# Altium schematic sheet SD_Card.SchDoc
size A4
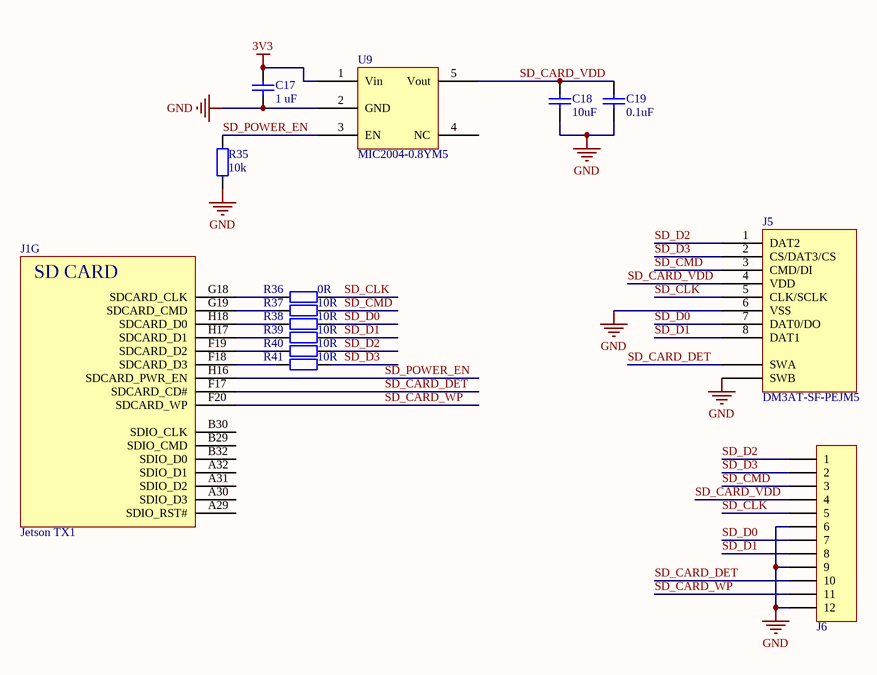
[diagram p0: SD_Card.SchDoc]

## Parts
C17  Capacitance: 1 uF  [0603C_M]  (hidden comment: GRM188R61A105KA61D)
C18  value 10uF  [0603C_M]  (hidden comment: GRM188R60J106ME47D)
C19  Capacitance: 0.1uF  [0402C_M]  (hidden comment: GRM155R71C104KA88D)
J1  Jetson TX1  [Nvidia Jetson TX1]  (part G of 14)
J5  DM3AT-SF-PEJM5  [DM3AT-SF-PEJM5]
J6  0527451297  [52745-1297]  (value not drawn)
R35  value 10k  [0402R_M]  (hidden comment: CRCW040210K0FKED)
R36  value 0R  [0402R_M]  (hidden comment: Generic resitor)
R37  value 10R  [0402R_M]  (hidden comment: CRCW040210R0FKED)
R38  value 10R  [0402R_M]  (hidden comment: CRCW040210R0FKED)
R39  value 10R  [0402R_M]  (hidden comment: CRCW040210R0FKED)
R40  value 10R  [0402R_M]  (hidden comment: CRCW040210R0FKED)
R41  value 10R  [0402R_M]  (hidden comment: CRCW040210R0FKED)
U9  MIC2004-0.8YM5  [SOT23_M5_M]

## Nets
3V3: C17.2 U9.1(Vin)
GND: C17.1 C18.1 C19.1 J5.6(VSS) J5.SWB J6.6 J6.9 J6.12 R35.1 U9.2(GND)
SD_CARD_DET: J1.F17(SDCARD_CD#) J5.SWA J6.10
SD_CARD_VDD: C18.2 C19.2 J5.4(VDD) J6.4 U9.5(Vout)
SD_CARD_WP: J1.F20(SDCARD_WP) J6.11
SD_CLK: J5.5(CLK/SCLK) J6.5 R36.2
SD_CMD: J5.3(CMD/DI) J6.3 R37.2
SD_D0: J5.7(DAT0/DO) J6.7 R38.2
SD_D1: J5.8(DAT1) J6.8 R39.2
SD_D2: J5.1(DAT2) J6.1 R40.2
SD_D3: J5.2(CS/DAT3/CS) J6.2 R41.2
SD_POWER_EN: J1.H16(SDCARD_PWR_EN) R35.2 U9.3(EN)
NetJ1_F18: J1.F18(SDCARD_D3) R41.1
NetJ1_F19: J1.F19(SDCARD_D2) R40.1
NetJ1_G18: J1.G18(SDCARD_CLK) R36.1
NetJ1_G19: J1.G19(SDCARD_CMD) R37.1
NetJ1_H17: J1.H17(SDCARD_D1) R39.1
NetJ1_H18: J1.H18(SDCARD_D0) R38.1

Not connected (* = marked no-connect by the designer): J1 A29(SDIO_RST#) A30(SDIO_D3) A31(SDIO_D2) A32(SDIO_D1) B29(SDIO_CMD) B30(SDIO_CLK) B32(SDIO_D0); U9 4(NC)

## Notes on the sheet
- (in symbol NVIDIA_Jetson_TX1, part G) SD CARD

## Library data of the parts
C17 = GRM188R61A105KA61D: CAP CER 1UF 10V X5R 0603; Manufacturer: Murata; Capacitance - nF: 1000 nF; Brand: Murata Electronics; Tolerance: 10 %; Case Height: 0.8 mm; Case Length: 1.6 mm; Temperature Coefficient / Code: +/- 15 %; Type: General Purpose MLCC; Supplier 1: Digi-Key; Manufacturer Part Number: GRM188R61A105KA61D; Stock 1: 2238936; Pricing 1: 1=0.1, 10=0.04, 100=0.0178, 500=0.0127, 1000=0.01 (USD); Dimensions: 0.8 mm W x 1.6 mm L x 0.8 mm H; Product Category: Multilayer Ceramic Capacitors MLCC - SMD/SMT; RoHS: Details; Voltage Rating DC: 10 V; Dielectric: X5R; Case Code - in: 0603; Case Code - mm: 1608; Minimum Operating Temperature: - 55 C; Maximum Operating Temperature: + 85 C; Product: General Type MLCCs; Case Width: 0.8 mm; Operating Temperature Range: - 55 C to + 85 C; Package / Case: 0603 (1608 metric); Packaging: Reel; Series: GRM; Factory Pack Quantity: 4000; Termination Style: SMD/SMT; ComponentLink1URL: https://datasheet.ciiva.com/18102/getdatasheetpartid-85467-18102910.pdf; ComponentLink1Description: https://datasheet.ciiva.com/18102/getdatasheetpartid-85467-18102910.pdf; ComponentLink2URL: https://datasheet.ciiva.com/19476/1857381-19476568.pdf; ComponentLink2Description: https://datasheet.ciiva.com/19476/1857381-19476568.pdf; ComponentLink3URL: https://datasheet.ciiva.com/131/partnumbering-e-01-131743.pdf; ComponentLink3Description: https://datasheet.ciiva.com/131/partnumbering-e-01-131743.pdf; ComponentLink4URL: https://datasheet.ciiva.com/22706/608985-22706782.pdf; ComponentLink4Description: https://datasheet.ciiva.com/22706/608985-22706782.pdf; ComponentLink5URL: https://datasheet.ciiva.com/131/partnumbering-e-01-131742.pdf; ComponentLink5Description: https://datasheet.ciiva.com/131/partnumbering-e-01-131742.pdf; ComponentLink6URL: https://datasheet.ciiva.com/7719/608985-7719036.pdf; ComponentLink6Description: https://datasheet.ciiva.com/7719/608985-7719036.pdf; ComponentLink7URL: https://datasheet.ciiva.com/16199/product-16199724.pdf; ComponentLink7Description: https://datasheet.ciiva.com/16199/product-16199724.pdf; ComponentLink8URL: https://datasheet.ciiva.com/131/partnumbering-e-01-131741.pdf; ComponentLink8Description: https://datasheet.ciiva.com/131/partnumbering-e-01-131741.pdf; Supplier Part Number 1: 490-1543-1-ND; Voltage Rating: 10 V
C18 = GRM188R60J106ME47D: CAP CER 10UF 6.3V X5R 0603; Manufacturer: Murata Electronics North America; Tolerance: ±20%; Supplier 1: Digi-Key; Manufacturer Part Number: GRM188R60J106ME47D; RoHS: RoHS Compliant; Category: Capacitors; Stock 1: 13697850; Pricing 1: 1=0.17, 10=0.123, 100=0.0578, 500=0.04052, 1000=0.03355 (USD); Packaging: Cut Tape (CT); Part Status: Active; Voltage - Rated: 6.3V; Temperature Coefficient: X5R; Operating Temperature: -55°C ~ 85°C; Features: -; Ratings: -; Applications: General Purpose; Mounting Type: Surface Mount, MLCC; Package / Case: 0603 (1608 Metric); Size / Dimension: 0.063" L x 0.031" W (1.60mm x 0.80mm); Height - Seated (Max): -; Thickness (Max): 0.035" (0.90mm); Lead Spacing: -; Lead Style: -; ComponentLink1URL: http://www.murata.com/~/media/webrenewal/support/library/catalog/products/capacitor/mlcc/c02e.pdf; ComponentLink1Description: http://www.murata.com/~/media/webrenewal/support/library/catalog/products/capacitor/mlcc/c02e.pdf; Supplier Part Number 1: 490-3896-1-ND
C19 = GRM155R71C104KA88D: CAP CER 0.1UF 16V X7R 0402; Manufacturer: Murata Electronics North America; Tolerance: ±10%; Supplier 1: Digi-Key; Manufacturer Part Number: GRM155R71C104KA88D; RoHS: RoHS Compliant; Category: Capacitors; Stock 1: 58190082; Pricing 1: 1=0.1, 10=0.013, 100=0.0059, 500=0.00422, 1000=0.00332, 2500=0.00302, 5000=0.00278 (USD); Packaging: Cut Tape (CT); Part Status: Active; Voltage - Rated: 16V; Temperature Coefficient: X7R; Operating Temperature: -55°C ~ 125°C; Features: -; Ratings: -; Applications: General Purpose; Mounting Type: Surface Mount, MLCC; Package / Case: 0402 (1005 Metric); Size / Dimension: 0.039" L x 0.020" W (1.00mm x 0.50mm); Height - Seated (Max): -; Thickness (Max): 0.022" (0.55mm); Lead Spacing: -; Lead Style: -; ComponentLink1URL: http://www.murata.com/~/media/webrenewal/support/library/catalog/products/capacitor/mlcc/c02e.ashx; ComponentLink1Description: http://www.murata.com/~/media/webrenewal/support/library/catalog/products/capacitor/mlcc/c02e.ashx; Supplier Part Number 1: 490-3261-1-ND
J1 = NVIDIA_Jetson_TX1: Nvidia computing module
J5 = DM3AT-SF-PEJM5: CONN MICRO SD CARD PUSH-PUSH R/A; Manufacturer: Hirose Electric (HRS); Product Training Modules: DM3 Series microSD Card Sockets; Featured Product: DM3AT Series; HTML Datasheet: DM3 Series microSD.html; Card Type: Secure Digital - microSD™; Number of Positions: 10 (8 + 2); Connector Type: Connector and Ejector; Insertion, Removal Method: Push In, Push Out; Online Catalog: DM3 Series; Other Names: HR1964CT; Supplier 1: Digi-Key; Manufacturer Part Number: DM3AT-SF-PEJM5; Stock 1: 32079; Pricing 1: 1=2.88, 10=2.614, 25=2.454, 50=2.3474, 100=2.2407, 250=2.0273, 500=1.8673 (USD); Standard Package: 1; Category: Connectors, Interconnects; Family: Memory Connectors - PC Card Sockets; Series: DM3; Packaging: Cut Tape (CT); Ejector Side: -; Mounting Type: Surface Mount, Right Angle; Features: Switch; Height Above Board: 0.066" (1.68mm); Mounting Feature: Normal, Standard - Top; Contact Finish: Gold; Contact Finish Thickness: -; ComponentLink1URL: https://datasheet.ciiva.com/46418/1697167-46418262.pdf; ComponentLink1Description: https://datasheet.ciiva.com/46418/1697167-46418262.pdf; ComponentLink2URL: https://datasheet.ciiva.com/3122/e60900232-3122534.pdf; ComponentLink2Description: https://datasheet.ciiva.com/3122/e60900232-3122534.pdf; ComponentLink3URL: https://datasheet.ciiva.com/16205/e60900232-16205727.pdf; ComponentLink3Description: https://datasheet.ciiva.com/16205/e60900232-16205727.pdf; ComponentLink4URL: https://datasheet.ciiva.com/16655/e60900232-16655643.pdf; ComponentLink4Description: https://datasheet.ciiva.com/16655/e60900232-16655643.pdf; ComponentLink5URL: https://datasheet.ciiva.com/683/e60900232-683394.pdf; ComponentLink5Description: https://datasheet.ciiva.com/683/e60900232-683394.pdf; ComponentLink6URL: https://datasheet.ciiva.com/683/e60900232-683393.pdf; ComponentLink6Description: https://datasheet.ciiva.com/683/e60900232-683393.pdf; ComponentLink7URL: https://datasheet.ciiva.com/46418/1697167-46418261.pdf; ComponentLink7Description: https://datasheet.ciiva.com/46418/1697167-46418261.pdf; ComponentLink8URL: https://datasheet.ciiva.com/683/e60900232-683395.pdf; ComponentLink8Description: https://datasheet.ciiva.com/683/e60900232-683395.pdf; Supplier Part Number 1: HR1964DKR-ND
J6 = 0527451297: CONN FFC TOP 12POS 0.50MM R/A; Manufacturer: Molex, LLC; Connector/Contact Type: Contacts, Top; Number of Positions: 12; Pitch: 0.020" (0.50mm); FFC, FCB Thickness: 0.30mm; Locking Feature: Slide Lock; Cable End Type: Straight; Voltage Rating: 50V; Current Rating: 0.5A; Mating Cycles: 20; Supplier 1: Digi-Key; Manufacturer Part Number: 0527451297; RoHS: RoHS Compliant; Category: Connectors, Interconnects; Stock 1: 6854; Pricing 1: 1=1.4, 10=1.234, 25=1.1616, 50=1.1132, 100=1.0648, 250=0.968, 500=0.8712 (USD); Packaging: Cut Tape (CT); Part Status: Active; Flat Flex Type: -; Mounting Type: Surface Mount, Right Angle; Termination: Solder; Height Above Board: 0.079" (2.00mm); Contact Material: Phosphor Bronze; Contact Finish: Gold; Housing Material: Polyamide (PA46), Nylon 4/6, Glass Filled; Actuator Material: -; Features: Solder Retention, Zero Insertion Force (ZIF); Operating Temperature: -20°C ~ 85°C; Material Flammability Rating: -; Contact Finish Thickness: -; Housing Color: -; Actuator Color: -; ComponentLink1URL: http://www.molex.com/pdm_docs/sd/527451297_sd.pdf; ComponentLink1Description: http://www.molex.com/pdm_docs/sd/527451297_sd.pdf; Supplier Part Number 1: WM6767CT-ND
R35 = CRCW040210K0FKED: RES SMD 10K OHM 1% 1/16W 0402; Manufacturer: Vishay Dale; Power (Watts): 0.063W, 1/16W; Temperature Coefficient: ±100ppm/°C; Supplier 1: Digi-Key; Manufacturer Part Number: CRCW040210K0FKED; RoHS: RoHS Compliant; Category: Resistors; Stock 1: 0; Pricing 1: 1=0.1, 10=0.037, 100=0.0149, 1000=0.0067, 2500=0.00582, 5000=0.00481 (USD); Packaging: Cut Tape (CT); Part Status: Active; Tolerance: ±1%; Composition: Thick Film; Features: Automotive AEC-Q200; Operating Temperature: -55°C ~ 155°C; Package / Case: 0402 (1005 Metric); Supplier Device Package: 0402; Size / Dimension: 0.039" L x 0.020" W (1.00mm x 0.50mm); Height - Seated (Max): 0.016" (0.40mm); Failure Rate: -; ComponentLink1URL: http://www.vishay.com/docs/20035/dcrcwe3.pdf; ComponentLink1Description: http://www.vishay.com/docs/20035/dcrcwe3.pdf; Supplier Part Number 1: 541-10.0KLCT-ND
R36 = Resistor
R37-R41 = CRCW040210R0FKED: RES SMD 10 OHM 1% 1/16W 0402; Manufacturer: Vishay Dale; Power (Watts): 0.063W, 1/16W; Temperature Coefficient: ±100ppm/°C; Supplier 1: Digi-Key; Manufacturer Part Number: CRCW040210R0FKED; RoHS: RoHS Compliant; Category: Resistors; Stock 1: 0; Pricing 1: 1=0.1, 10=0.037, 100=0.0149, 1000=0.0067, 2500=0.00582, 5000=0.00481 (USD); Packaging: Cut Tape (CT); Part Status: Active; Tolerance: ±1%; Composition: Thick Film; Features: Automotive AEC-Q200; Operating Temperature: -55°C ~ 155°C; Package / Case: 0402 (1005 Metric); Supplier Device Package: 0402; Size / Dimension: 0.039" L x 0.020" W (1.00mm x 0.50mm); Height - Seated (Max): 0.016" (0.40mm); Failure Rate: -; ComponentLink1URL: http://www.vishay.com/docs/20035/dcrcwe3.pdf; ComponentLink1Description: http://www.vishay.com/docs/20035/dcrcwe3.pdf; Supplier Part Number 1: 541-10.0LCT-ND
U9 = MIC2004-0.8YM5: IC DISTRIBUTION SW 0.8A SOT23-5; Manufacturer: Microchip Technology; Switch Type: General Purpose; Number of Outputs: 1; Ratio - Input:Output: 1:1; Output Configuration: High Side; Output Type: P-Channel; Interface: On/Off; Voltage - Load: 2.5 V ~ 5.5 V; Voltage - Supply (Vcc/Vdd): Not Required; Current - Output (Max): 800mA; Rds On (Typ): 70 mOhm; Input Type: Non-Inverting; Fault Protection: Current Limiting (Fixed), Over Temperature; Supplier 1: Digi-Key; Manufacturer Part Number: MIC2004-0.8YM5; RoHS: RoHS Compliant; Category: Integrated Circuits (ICs); Stock 1: 0; Pricing 1: 1050=0 (USD); Packaging: Tube; Part Status: Obsolete; Features: Load Discharge; Operating Temperature: -40°C ~ 85°C (TA); Package / Case: SC-74A, SOT-753; Supplier Device Package: SOT-23-5; ComponentLink1URL: http://www.microchip.com/mymicrochip/filehandler.aspx?ddocname=en579487; ComponentLink1Description: http://www.microchip.com/mymicrochip/filehandler.aspx?ddocname=en579487; Supplier Part Number 1: MIC2004-0.8YM5-ND